# EAGLE design featherwing_RGBLEDmatrixPanel (EAGLE 7.3.0)
DOC_NAME: Featherwing, RGB Matrix Adaptor; REVISION: A
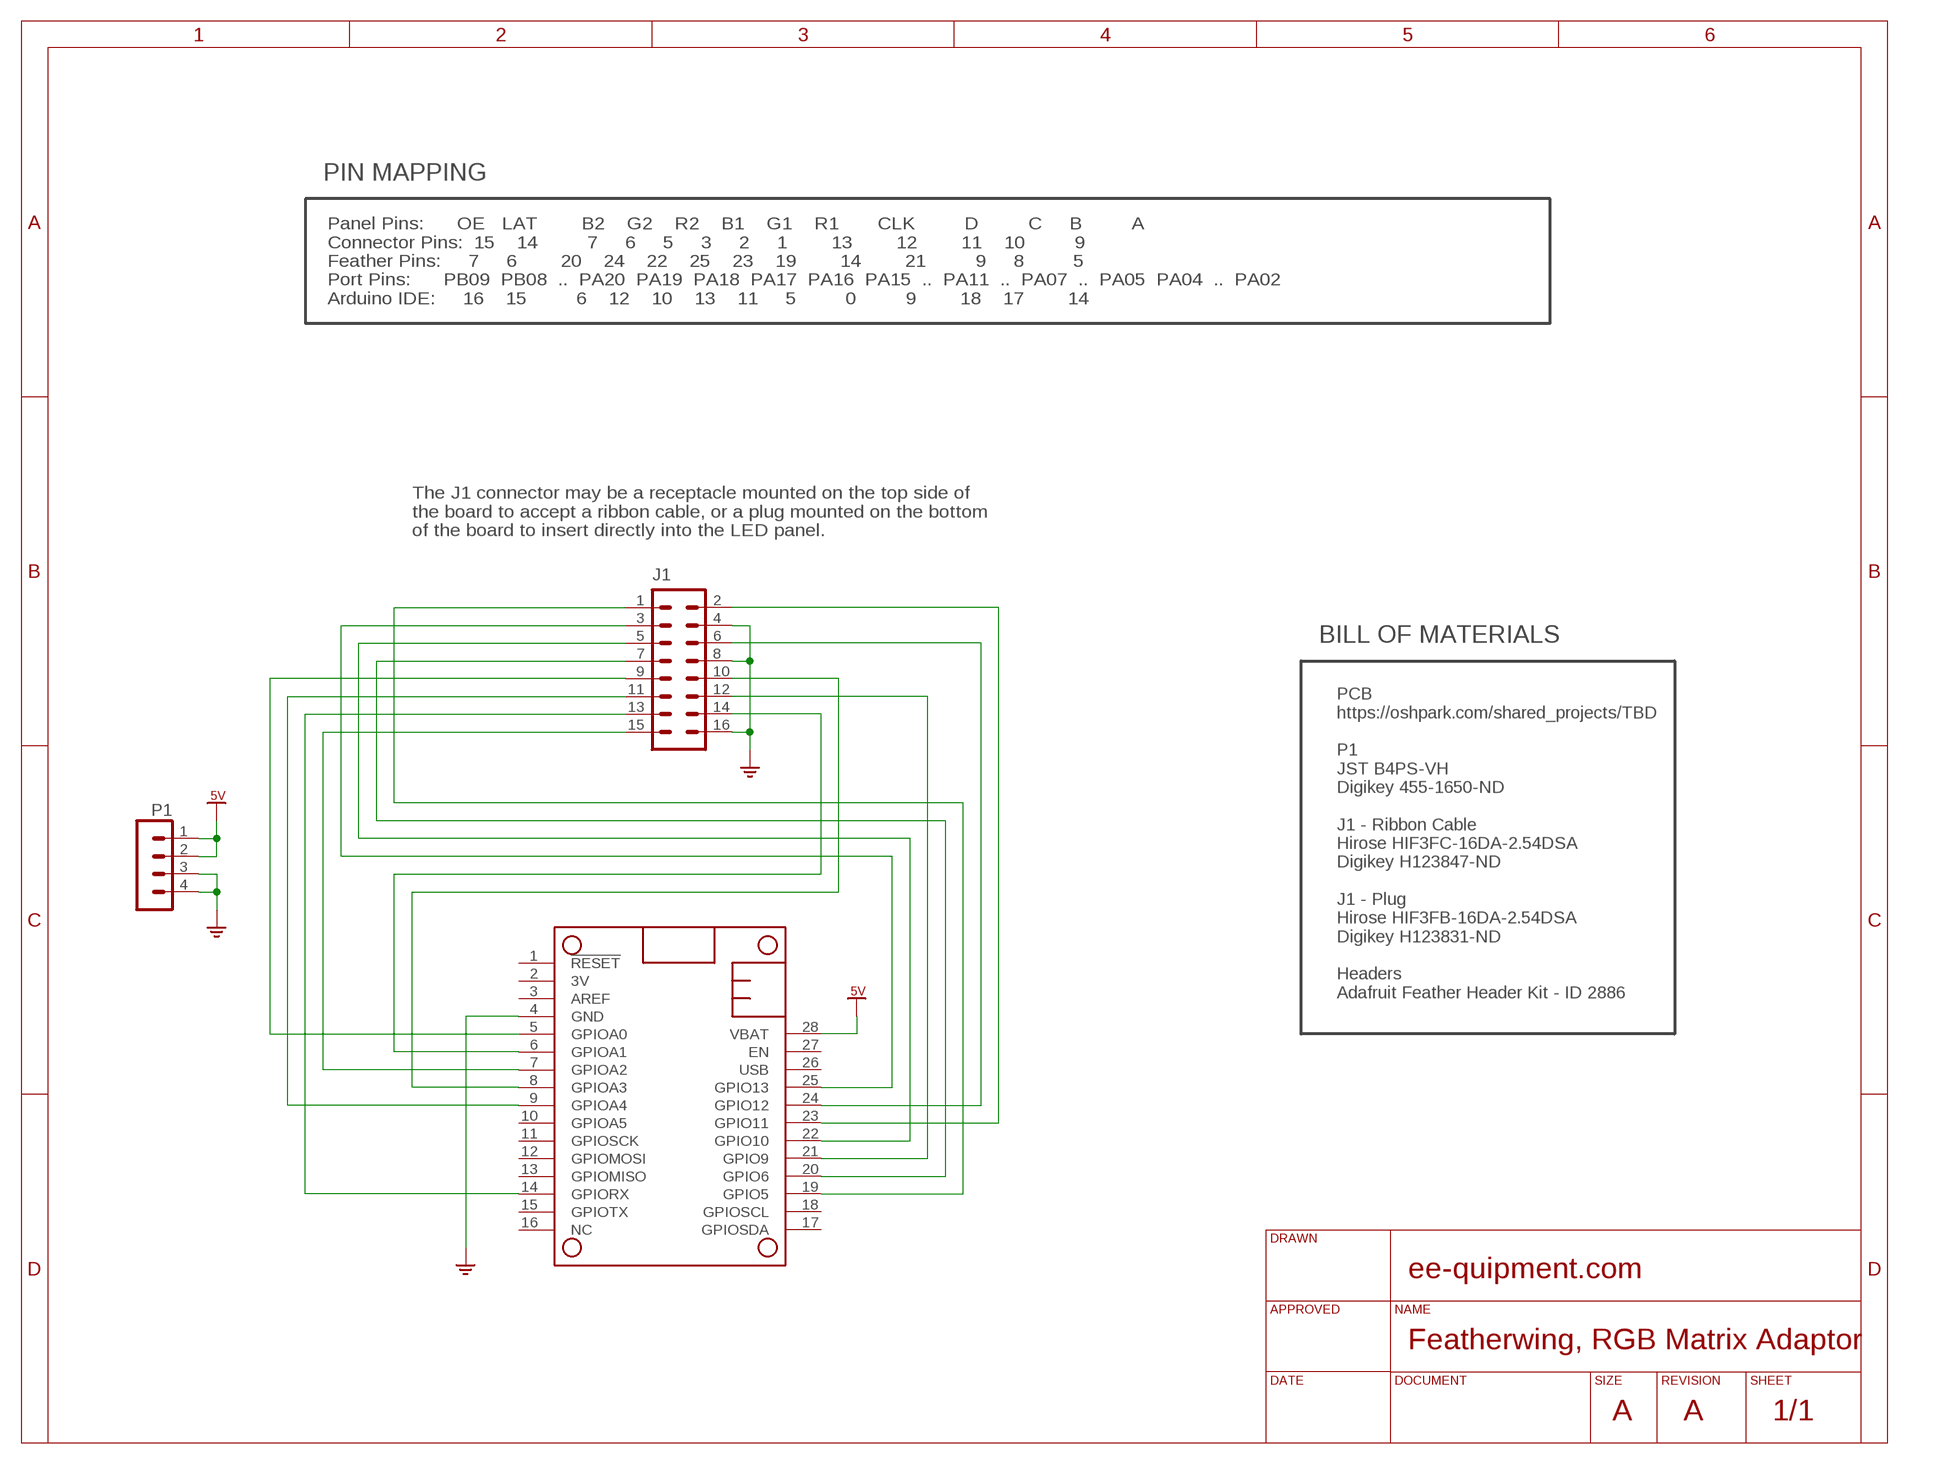
[diagram p0: schematic, sheet 1]

## Parts
J1  HDR_16  [HDR_16]
MS1  MICROSHIELD  [MICROSHIELD]
P1  JST_B4P-VHRA  [JST_B4PS-VH]

## Nets
5V: MS1.28(VBAT) P1.1 P1.2
GND: J1.4 J1.8 J1.16 MS1.4(GND) P1.3 P1.4
N$1: J1.9 MS1.5(GPIOA0)
N$2: J1.14 MS1.6(GPIOA1)
N$3: J1.15 MS1.7(GPIOA2)
N$4: J1.10 MS1.8(GPIOA3)
N$5: J1.11 MS1.9(GPIOA4)
N$6: J1.13 MS1.14(GPIORX)
N$7: J1.1 MS1.19(GPIO5)
N$8: J1.7 MS1.20(GPIO6)
N$9: J1.12 MS1.21(GPIO9)
N$10: J1.5 MS1.22(GPIO10)
N$11: J1.2 MS1.23(GPIO11)
N$12: J1.6 MS1.24(GPIO12)
N$13: J1.3 MS1.25(GPIO13)
Unconnected: MS1.1(!RESET) MS1.2(3V) MS1.3(AREF) MS1.10(GPIOA5) MS1.11(GPIOSCK) MS1.12(GPIOMOSI) MS1.13(GPIOMISO) MS1.15(GPIOTX) MS1.16(NC) MS1.17(GPIOSDA) MS1.18(GPIOSCL) MS1.26(USB) MS1.27(EN)

## Notes on the sheet
- PIN MAPPING
- Panel Pins:      OE   LAT        B2    G2    R2    B1    G1    R1       CLK         D         C     B         A
      Connector Pins:  15    14         7     6     5     3     2     1        13        12        11    10         9
      Feather Pins:     7     6        20    24    22    25    23    19        14        21         9     8         5
      Port Pins:      PB09  PB08  ..  PA20  PA19  PA18  PA17  PA16  PA15  ..  PA11  ..  PA07  ..  PA05  PA04  ..  PA02
      Arduino IDE:     16    15         6    12    10    13    11     5         0         9        18    17        14
- The J1 connector may be a receptacle mounted on the top side of
  the board to accept a ribbon cable, or a plug mounted on the bottom
  of the board to insert directly into the LED panel.
- BILL OF MATERIALS
- PCB
  https://oshpark.com/shared_projects/TBD
  
  P1
  JST B4PS-VH
  Digikey 455-1650-ND  
  
  J1 - Ribbon Cable
  Hirose HIF3FC-16DA-2.54DSA
  Digikey H123847-ND
  
  J1 - Plug
  Hirose HIF3FB-16DA-2.54DSA
  Digikey H123831-ND
  
  Headers
  Adafruit Feather Header Kit - ID 2886

## Library data of the parts
J1 = 0_mitchell:HDR_16
MS1 = microbuilder:MICROSHIELD
P1 = 0_mitchell:JST_B4P-VH: HEADER

## Net classes
0 default: width 0.203 mm, clearance 0.203 mm
1 high current: width 0.305 mm, clearance 0.305 mm

## Board
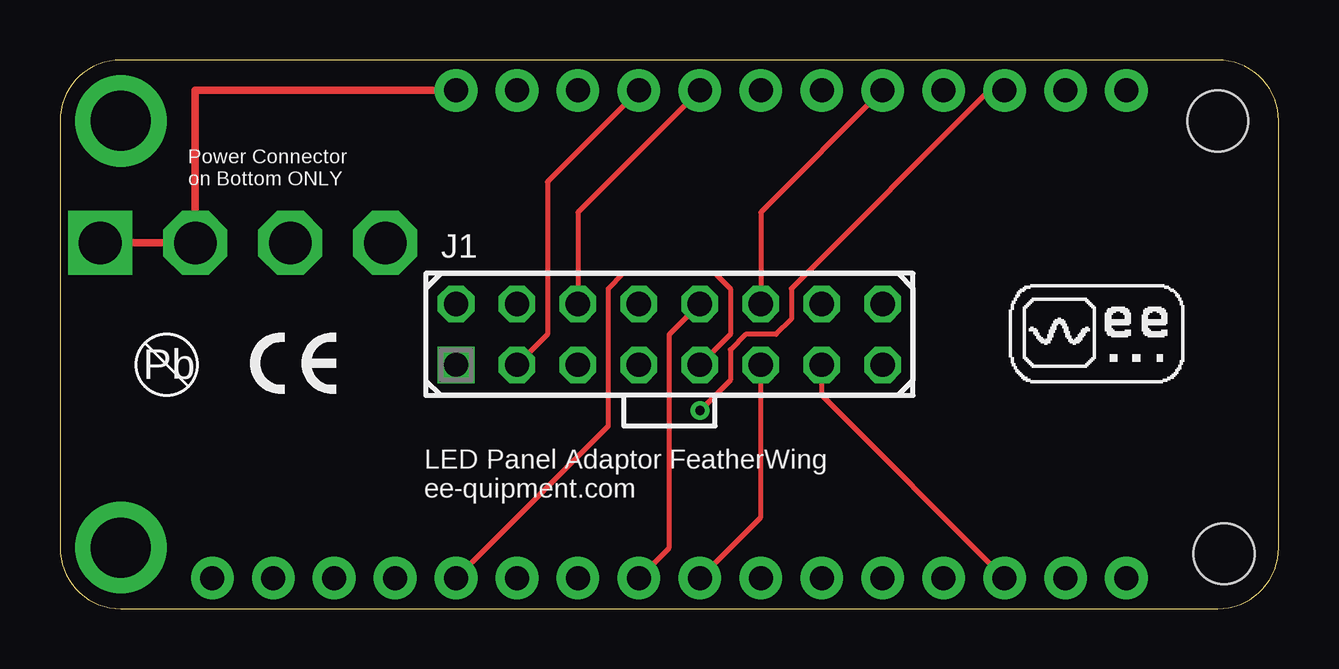
[diagram p1: board, top side]
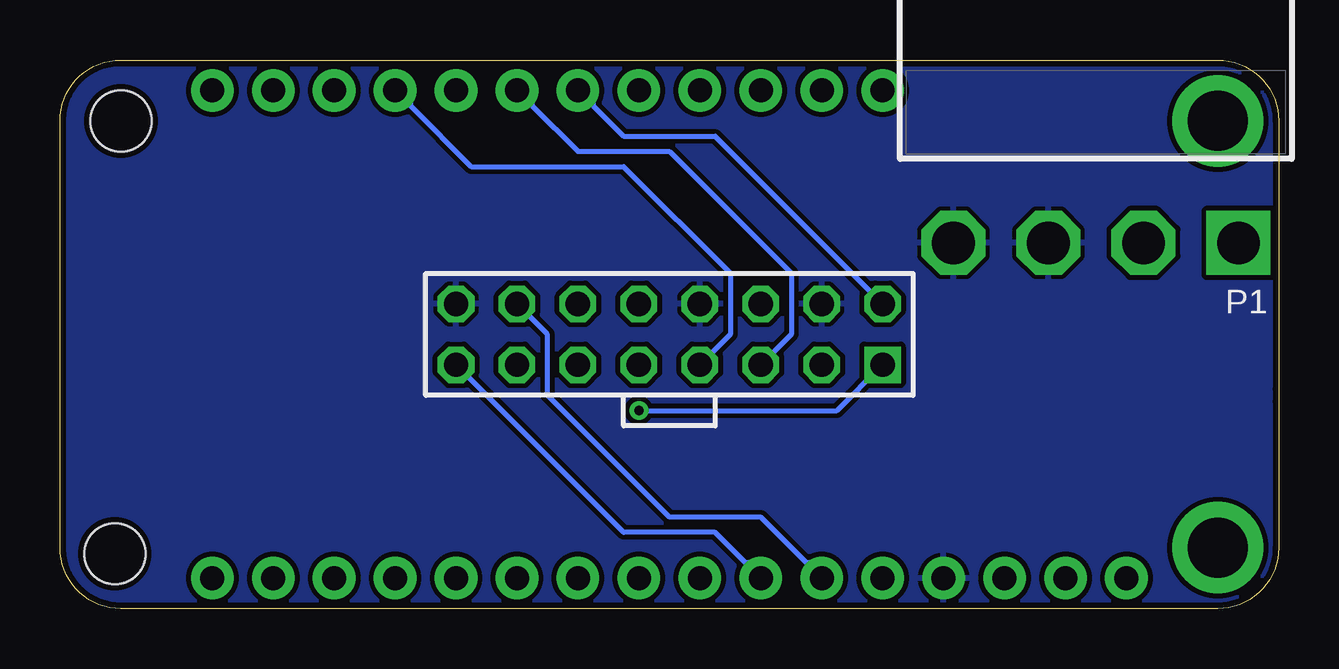
[diagram p2: board, bottom side, seen from below]

Size 50.8 x 22.86 mm. Coordinates in mm from the lower left corner, seen from the top.
Copper layers (1*16): Top 0.0356mm / dielectric 1.5011mm / Bottom 0.0356mm
Design rules "gold_phoenix_2_layer *": minimum track width 7mil, minimum drill 15mil, track to track 7mil, track to pad 7mil, pad to pad 7mil, via to via 7mil, smd to smd 7mil, copper to edge 10mil, drill to drill 16mil, minimum pad ring 10mil, minimum via ring 8mil, stop-mask expansion 2mil, vias tented up to drill 20mil, thermal gap 7mil

### Footprints (pad centres in the part's own frame; a part is rotated, then mirrored left to right if it is on the bottom)
HDR_16 = drill 1.016 square: 1 -8.89,-1.27 | drill 1.016 octagon: 2 -8.89,1.27; 3 -6.35,-1.27; 4 -6.35,1.27; 5 -3.81,-1.27; 6 -3.81,1.27; 7 -1.27,-1.27; 8 -1.27,1.27; 9 1.27,-1.27; 10 1.27,1.27; 11 3.81,-1.27; 12 3.81,1.27; 13 6.35,-1.27; 14 6.35,1.27; 15 8.89,-1.27; 16 8.89,1.27
MICROSHIELD = drill 1 pad 1.778: 1 6.35,1.27; 2 8.89,1.27; 3 11.43,1.27; 4 13.97,1.27; 5 16.51,1.27; 6 19.05,1.27; 7 21.59,1.27; 8 24.13,1.27; 9 26.67,1.27; 10 29.21,1.27; 11 31.75,1.27; 12 34.29,1.27; 13 36.83,1.27; 14 39.37,1.27; 15 41.91,1.27; 16 44.45,1.27; 17 44.45,21.59; 18 41.91,21.59; 19 39.37,21.59; 20 36.83,21.59; 21 34.29,21.59; 22 31.75,21.59; 23 29.21,21.59; 24 26.67,21.59; 25 24.13,21.59; 26 21.59,21.59; 27 19.05,21.59; 28 16.51,21.59 | drill 2.5 pad 3.81: P$1 2.54,20.32; P$2 2.54,2.54 | hole 2.54: 48.26,20.32; 48.514,2.286
JST_B4PS-VH = drill 1.778 square: 1 -5.94,0 | drill 1.778 octagon: 2 -1.98,0; 3 1.98,0; 4 5.94,0

### Placement (x,y rotation side)
J1  25.4,11.43 0 top
MS1  0,0 0 top
P1  7.62,15.24 180 bottom
U$1  [AGENCY_MARK_NO_PB]  4.45,10.16 0 top
U$2  [EE_QUIPMENT_LOGO_128X128]  39.53,9.37 0 top
U$3  [AGENCY_MARK_CE]  9.84,10.48 0 top
U$4  [EE-QUIPMENT_FORMAT_A_L]  -57.15,-134.62 0 top  (outside the outline)

### Tracks (layer width: path | path; a pad name or v marks a point on that pad's centre or on a via)
5V
  Top 0.305: P1.1 P1.2 5.64,21.59 MS1.28
GND
  pour Bottom: 0,0 50.8,0 50.8,22.86 0,22.86
N$1
  Top 0.203: J1.9 27.94,11.43 27.94,13.34 27.3,13.97 23.5,13.97 22.86,13.34 22.86,7.62 MS1.5
N$2
  Bottom 0.203: J1.14 30.48,11.43 30.48,8.89 25.4,3.81 21.59,3.81 19.68,1.91 19.05,1.91 MS1.6
N$3
  Bottom 0.203: J1.15 27.3,3.17 23.5,3.17 22.23,1.91 21.59,1.91 MS1.7
N$4
  Top 0.203: J1.10 25.4,11.43 25.4,2.54 MS1.8
N$5
  Top 0.203: J1.11 29.21,3.81 MS1.9
N$6
  Top 0.203: J1.13 31.75,8.89 MS1.14
N$7  (via drill 0.38)
  Top 0.203: v26.67,8.26 27.94,9.53 27.94,10.79 28.57,11.43 29.84,11.43 30.48,12.06 30.48,13.34 38.73,21.59 MS1.19
  Bottom 0.203: J1.1 18.41,8.26 v26.67,8.26
N$8
  Bottom 0.203: J1.7 22.86,11.43 22.86,13.97 27.3,18.41 33.66,18.41 36.2,20.95 36.2,21.59 MS1.20
N$9
  Top 0.203: J1.12 29.21,16.51 MS1.21
N$10
  Bottom 0.203: J1.5 20.32,11.43 20.32,13.97 25.4,19.05 29.21,19.05 31.11,20.95 31.11,21.59 MS1.22
N$11
  Bottom 0.203: J1.2 23.5,19.68 27.3,19.68 28.57,20.95 28.57,21.59 MS1.23
N$12
  Top 0.203: J1.6 21.59,16.51 MS1.24
N$13
  Top 0.203: J1.3 20.32,11.43 20.32,17.78 MS1.25

### Text on the board
bStop: rev
ASSY_DRAWING_TEXT: NOTES: | (UNLESS OTHERWISE SPECIFIED) | 1. SQUARE PAD ON BOARD INDICATES PIN 1 | 2. SMT COMPONENT CENTROID FILE "_centroid.csv" | 3. SOLDER PASTE STENCIL FILE "eeXXX_.tps" | ASSEMBLY DRAWING
FAB_DRAWING_TEXT: NOTES: | (UNLESS OTHERWISE SPECIFIED) | FABRICATE TO MEET EU RoHS DIRECTIVE | MATERIAL | FR-4 Tg130 OR Tg170 GLASS EPOXY, 2 LAYERS | THICKNESS | 0.062" | COPPER | 1 0Z | FINISH | ENIG OR LEAD-FREE HASL | EDGES | ROUTE TO WITHIN +/- 0.010" OF OLN | SOLDER MASK | SMOBC, SOLDER MASK ON BARE COPPER, | BOTH SIDES, BLACK | FINISH | SCREEN USING NON-CONDUCTIVE | WHITE ENAMEL | LAYER STACKUP | GKO - ROUTING LAYER | XLN - DRILL DATA | GTO - TOP SILK | GTS - TOP STOP | GTL - TOP COPPER | GBL - BOTTOM COPPER | GBS - BOTTOM STOP | FABRICATION DRAWING
_tsilk: Power Connector / on Bottom ONLY | LED Panel Adaptor FeatherWing / ee-quipment.com